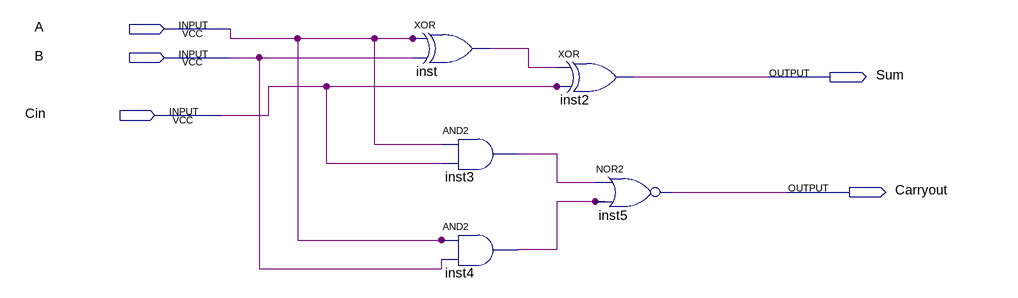
[diagram p0: schematic sheet]
// Quartus schematic Lab4DE12.bdf as structural Verilog: 5 symbols, 5 pins
module Lab4DE12 (
  input  A,
  input  B,
  input  Cin,
  output Sum,
  output Carryout
);

  wire inst3_out, inst4_out, inst_out;

  xor inst (inst_out, A, B);
  and inst3 (inst3_out, A, Cin);
  and inst4 (inst4_out, A, B);
  xor inst2 (Sum, inst_out, Cin);
  nor inst5 (Carryout, inst3_out, inst4_out);
endmodule
